# EAGLE design MLS01-TG000-C08 (EAGLE 9.6.2)
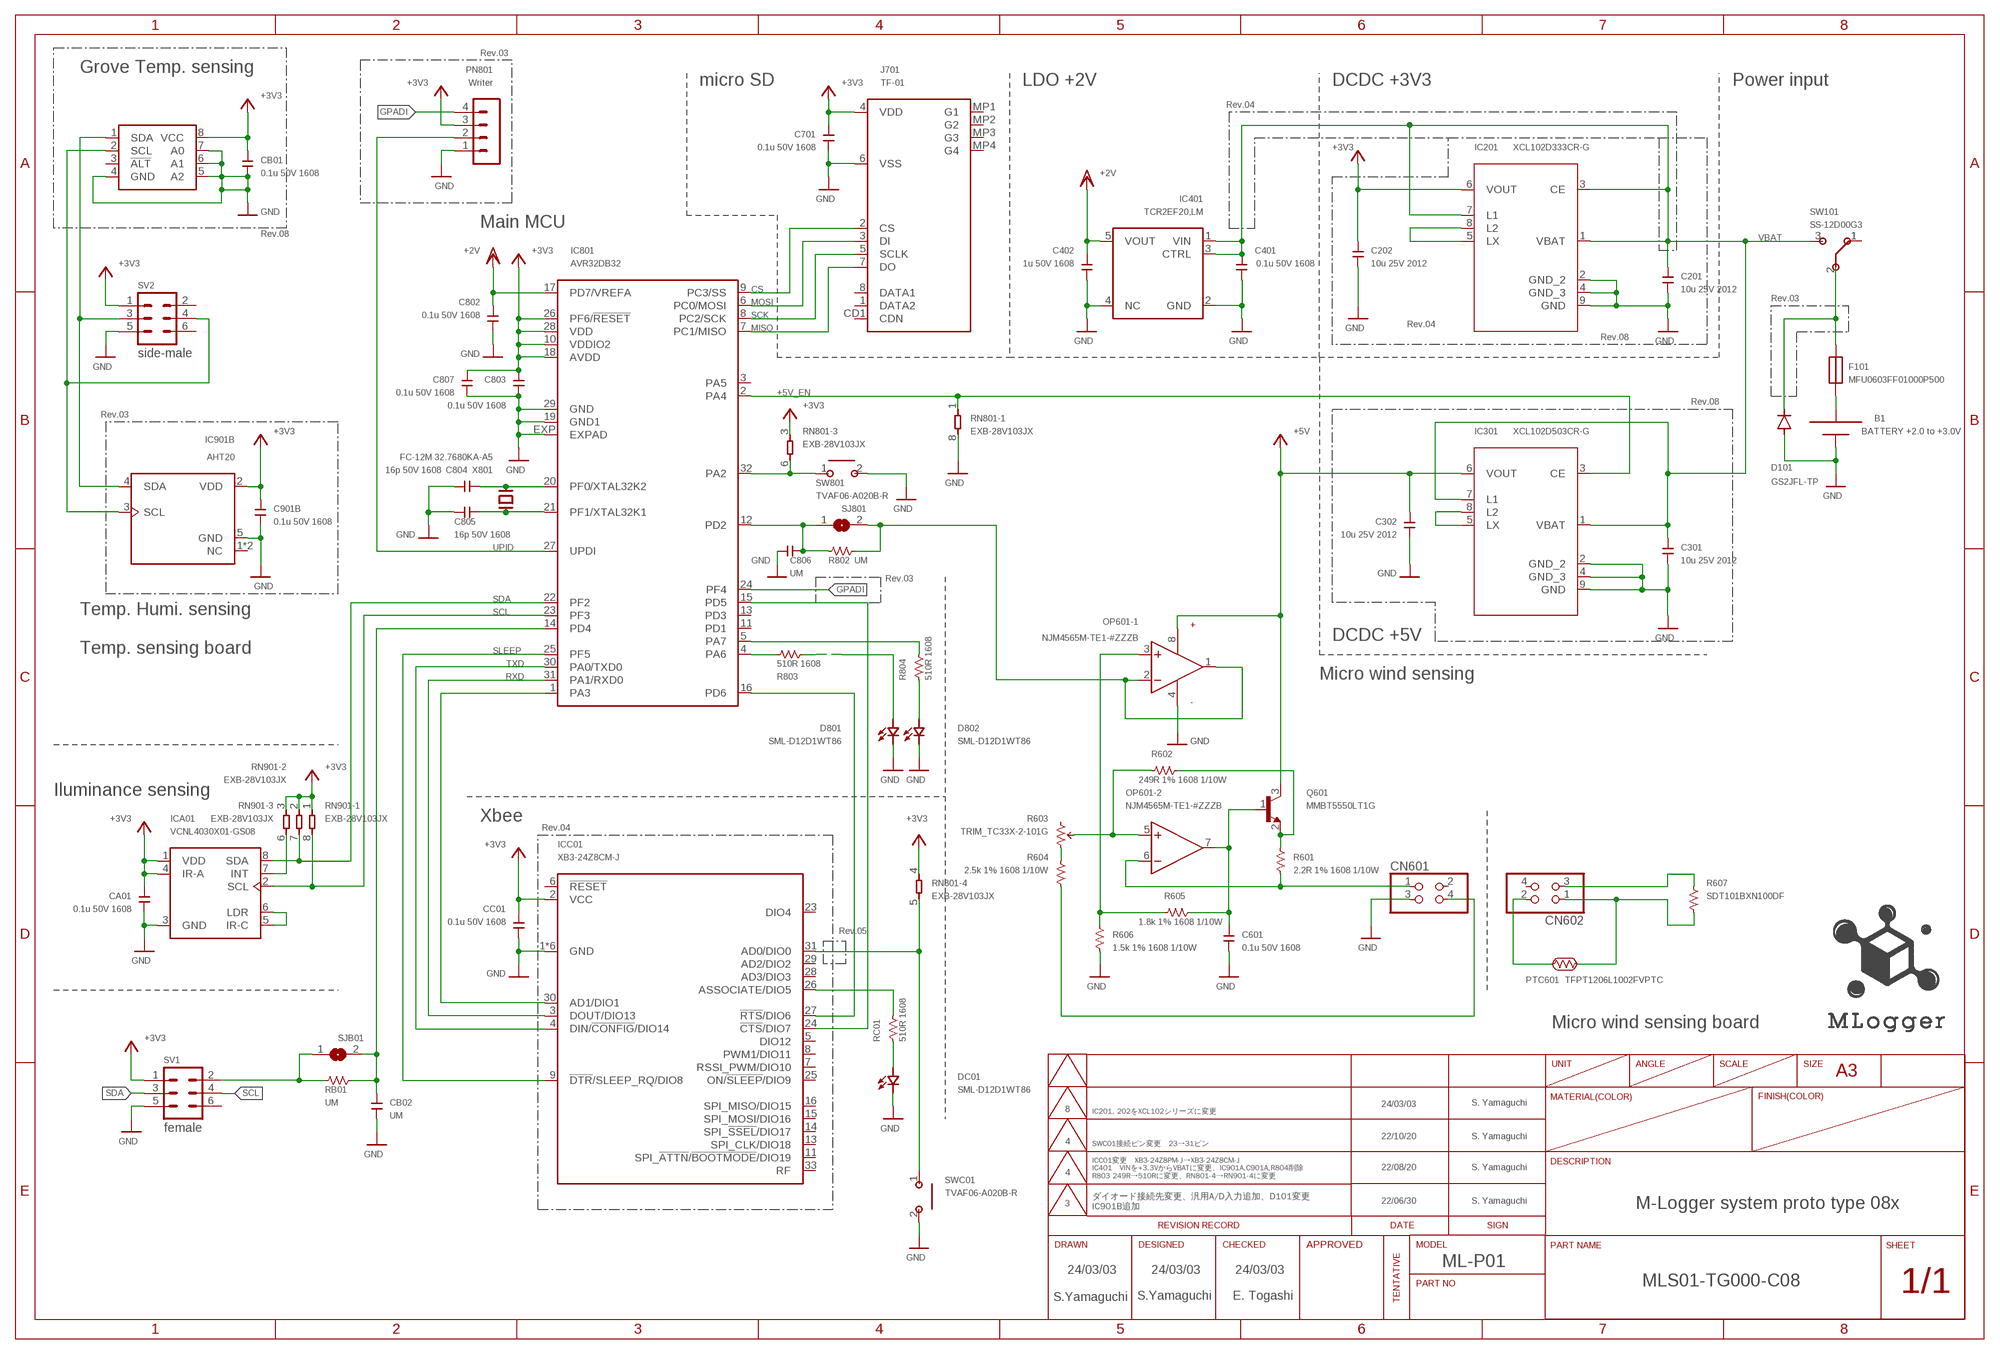
[diagram p0: schematic, sheet 1]

## Parts
B1  BATTERY +2.0 to +3.0V  BATTERY  [PAD]
C201  10u 25V 2012  CL21B105KBFNNNG  [C-2012/0805]
C202  10u 25V 2012  CL21B105KBFNNNG  [C-2012/0805]
C301  10u 25V 2012  CL21B105KBFNNNG  [C-2012/0805]
C302  10u 25V 2012  CL21B105KBFNNNG  [C-2012/0805]
C401  0.1u 50V 1608  CL10A105KP8NNNC  [C-1608/0603]
C402  1u 50V 1608  CL10A105KP8NNNC  [C-1608/0603]
C601  0.1u 50V 1608  CL10A105KP8NNNC  [C-1608/0603]
C701  0.1u 50V 1608  CL10A105KP8NNNC  [C-1608/0603]
C802  0.1u 50V 1608  CL10A105KP8NNNC  [C-1608/0603]
C803  0.1u 50V 1608  CL10A105KP8NNNC  [C-1608/0603]
C804  16p 50V 1608  CL10A105KP8NNNC  [C-1608/0603]
C805  16p 50V 1608  CL10A105KP8NNNC  [C-1608/0603]
C806  UM  CL10A105KP8NNNC  [C-1608/0603]
C807  0.1u 50V 1608  CL10A105KP8NNNC  [C-1608/0603]
C901B  0.1u 50V 1608  CL10A105KP8NNNC  [C-1608/0603]
CA01  0.1u 50V 1608  CL10A105KP8NNNC  [C-1608/0603]
CB01  0.1u 50V 1608  CL10A105KP8NNNC  [C-1608/0603]
CB02  UM  CL10A105KP8NNNC  [C-1608/0603]
CC01  0.1u 50V 1608  CL10A105KP8NNNC  [C-1608/0603]
CN601  PINHD-2X2  [2X02]
CN602  PINHD-2X2/90  [2X02/90]
D101  GS2JFL-TP  [SODFL5629X125N]
D801  SML-D12D1WT86  [SMD-1608]
D802  SML-D12D1WT86  [SMD-1608]
DC01  SML-D12D1WT86  [SMD-1608]
F101  MFU0603FF01000P500  [FUSC1608X60N]
IC201  XCL102D333CR-G  XCL102D503CR-GCL-2025-02_TOR  [CL-2025-02_TOR]
IC301  XCL102D503CR-G  XCL102D503CR-GCL-2025-02_TOR  [CL-2025-02_TOR]
IC401  TCR2EF20,LM  [SOT23-5L]
IC801  AVR32DB32  [HVQFN32]
IC901B  AHT20  [PSON100P300X300X110-6N]
ICA01  VCNL4030X01-GS08  [VISHAY_VCNL4030X01-GS08]
ICC01  XB3-24Z8CM-J  [XCVR_XB3-24Z8CM-J]
J701  TF-01  [TF-01A]
OP601  NJM4565M-TE1-#ZZZB  [SOIC127P680X175-8N]
PN801  Writer  MA04-1  [MA04-1]
PTC601  TFPT1206L1002FVPTC  [C1206]
Q601  MMBT5550LT1G  [SOT95P237X111-3N]
R601  2.2R 1% 1608 1/10W  R-1608  [R-1608/0603]
R602  249R 1% 1608 1/10W  R-1608  [R-1608/0603]
R603  TRIM_TC33X-2-101G  [TRIM_TC33X-2-101G]
R604  2.5k 1% 1608 1/10W  R-1608  [R-1608/0603]
R605  1.8k 1% 1608 1/10W  R-1608  [R-1608/0603]
R606  1.5k 1% 1608 1/10W  R-1608  [R-1608/0603]
R607  SDT101BXN100DF  [SDT101BXN100DF]
R802  UM  R-1608  [R-1608/0603]
R803  510R 1608  R-1608  [R-1608/0603]
R804  510R 1608  R-1608  [R-1608/0603]
RB01  UM  R-1608  [R-1608/0603]
RC01  510R 1608  R-1608  [R-1608/0603]
RN801  EXB-28V103JX  [RESCAXS50P200X100X45-8N]
RN901  EXB-28V103JX  [RESCAXS50P200X100X45-8N]
SJ801  SJ  [SJ]
SJB01  SJ  [SJ]
SV1  female  MA03-2-FEMALE  [MA03-2-FEMALE]
SV2  side-male  MA03-2-SIDE-MALE  [MA03-2-SIDE-MALE]
SW101  SS-12D00G3  [SS-12D00G3]
SW801  TVAF06-A020B-R  [TVAF06-A020B-R]
SWC01  TVAF06-A020B-R  [TVAF06-A020B-R]
U$4  P3T1570DP  [TSSOP8]
X801  FC-12M 32.7680KA-A5  SMD-CRYSTAL-32.768KHZ-12.5PF-20PPM-90K(2P-L2.0X1.2MM)  [X2-SMD-L2.0X1.2X0.55MM]

## Nets
+2V [PWR]: C402.P$1 C802.P$1 IC401.5(VOUT) IC801.17(PD7/VREFA)
+3V3: C202.P$2 C701.P$1 C803.P$1 C807.P$1 C901B.P$1 CA01.P$1 CB01.P$1 CC01.P$1 IC201.6(VOUT) IC801.10(VDDIO2) IC801.18(AVDD) IC801.26(PF6/!RESET) IC801.28(VDD) IC901B.2(VDD) ICA01.1(VDD) ICA01.4(IR-A) ICC01.2(VCC) J701.4(VDD) PN801.3 RN801.3 RN801.4 RN901.1 RN901.2 RN901.3 SV1.1 SV2.1 U$4.8(VCC)
+5V: C302.P$2 IC301.6(VOUT) OP601.8(-1:V+) Q601.3(C)
+5V_EN: IC301.3(CE) IC801.2(PA4) RN801.1
CS: IC801.9(PC3/SS) J701.2(CS)
GND: B1.2(-) C201.P$1 C202.P$1 C301.P$1 C302.P$1 C401.P$2 C402.P$2 C601.P$2 C701.P$2 C802.P$2 C803.P$2 C804.P$2 C805.P$2 C806.P$2 C807.P$2 C901B.P$2 CA01.P$2 CB01.P$2 CB02.P$2 CC01.P$2 CN601.3 D101.2(A) D801.2(C) D802.2(C) DC01.2(C) IC201.2(GND_2) IC201.4(GND_3) IC201.9(GND) IC301.2(GND_2) IC301.4(GND_3) IC301.9(GND) IC401.2(GND) IC401.4(NC) IC801.19(GND1) IC801.29(GND) IC801.EXP(EXPAD) IC901B.5(GND) ICA01.3(GND) ICC01.1(GND) ICC01.10(GND) ICC01.12(GND) ICC01.21(GND) ICC01.32(GND) ICC01.34(GND) J701.6(VSS) OP601.4(-1:V-) PN801.1 R606.1 RN801.8 SV1.5 SV2.5 SW801.2 SWC01.2 U$4.4(GND) U$4.5(A2) U$4.6(A1) U$4.7(A0)
GND_PIN: CN602.1 PTC601.1 R607.1
GPADI: IC801.24(PF4) PN801.4
MISO: IC801.7(PC1/MISO) J701.7(DO)
MOSI: IC801.6(PC0/MOSI) J701.3(DI)
N$1: D101.1(C) F101.2 SW101.2
N$2: CN602.3 R607.2
N$3: CN601.4 R604.1
N$4: RB01.1 SJB01.1 SV1.2
N$6: IC201.5(LX) IC201.8(L2)
N$8: IC301.5(LX) IC301.8(L2)
N$9: IC801.5(PA7) R804.2
N$10: D802.1(A) R804.1
N$11: OP601.1(-1:OUT) OP601.2(-1:-IN) R802.2 SJ801.2
N$12: ICC01.26(ASSOCIATE/DIO5) RC01.2
N$13: DC01.1(A) RC01.1
N$14: CN602.2 PTC601.2
N$15: OP601.3(-1:+IN) R605.1 R606.2
N$16: OP601.5(-2:+IN) R602.1 R603.2
N$17: R603.3 R604.2
N$18: IC801.4(PA6) R803.1
N$19: C601.P$1 OP601.7(-2:OUT) Q601.1(B) R605.2
N$20: CN601.1 OP601.6(-2:-IN) R601.1
N$21: IC801.1(PA3) ICC01.30(AD1/DIO1)
N$22: IC801.15(PD5) ICC01.24(!CTS!/DIO7)
N$23: IC801.16(PD6) ICC01.27(!RTS!/DIO6)
N$25: C806.P$1 IC801.12(PD2) R802.1 SJ801.1
N$26: B1.1(+) F101.1
N$30: Q601.2(E) R601.2 R602.2
N$31: ICA01.7(INT) RN901.6
N$39: D801.1(A) R803.2
N$49: IC801.32(PA2) RN801.6 SW801.1
N$50: C804.P$1 IC801.20(PF0/XTAL32K2) X801.1
N$51: C805.P$1 IC801.21(PF1/XTAL32K1) X801.2
N$56: ICC01.31(AD0/DIO0) RN801.5 SWC01.1
N$57: ICA01.5(IR-C) ICA01.6(LDR)
N$61: CB02.P$1 IC801.14(PD4) RB01.2 SJB01.2
RXD: IC801.31(PA1/RXD0) ICC01.3(DOUT/DIO13)
SCK: IC801.8(PC2/SCK) J701.5(SCLK)
SCL: IC801.23(PF3) IC901B.3(SCL) ICA01.2(SCL) RN901.8 SV1.4 SV2.4 U$4.2(SCL)
SDA: IC801.22(PF2) IC901B.4(SDA) ICA01.8(SDA) RN901.7 SV1.3 SV2.3 U$4.1(SDA)
SLEEP: IC801.25(PF5) ICC01.9(!DTR!/SLEEP_RQ/DIO8)
TXD: IC801.30(PA0/TXD0) ICC01.4(DIN/!CONFIG!/DIO14)
UPID: IC801.27(UPDI) PN801.2
VBAT: C201.P$2 C301.P$2 C401.P$1 IC201.1(VBAT) IC201.3(CE) IC201.7(L1) IC301.1(VBAT) IC301.7(L1) IC401.1(VIN) IC401.3(CTRL) SW101.3
Unconnected: CN601.2 CN602.4 IC801.3(PA5) IC801.11(PD1) IC801.13(PD3) IC901B.1(NC) IC901B.6(NC) ICC01.5(DIO12) ICC01.6(!RESET) ICC01.7(RSSI_PWM/DIO10) ICC01.8(PWM1/DIO11) ICC01.11(SPI_!ATTN!/!BOOTMODE!/DIO19) ICC01.13(SPI_CLK/DIO18) ICC01.14(SPI_!SSEL!/DIO17) ICC01.15(SPI_MOSI/DIO16) ICC01.16(SPI_MISO/DIO15) ICC01.23(DIO4) ICC01.25(ON/!SLEEP!/DIO9) ICC01.28(AD3/DIO3) ICC01.29(AD2/DIO2) ICC01.33(RF) J701.1(DATA2) J701.8(DATA1) J701.CD1(CDN) J701.MP1(G1) J701.MP2(G2) J701.MP3(G3) J701.MP4(G4) R603.1 RN801.2 RN801.7 RN901.4 RN901.5 SV1.6 SV2.2 SV2.6 SW101.1 U$4.3(!ALT)

## Notes on the sheet
- Rev.03
- Grove Temp. sensing
- micro SD | LDO +2V | DCDC +3V3 | Power input
- Rev.04
- Main MCU
- Rev.08
- Rev.03
- Rev.04
- Rev.08
- Rev.08
- Rev.03
- Rev.03
- Temp. Humi. sensing
- DCDC +5V
- Temp. sensing board
- Micro wind sensing
- Iluminance sensing
- Xbee
- Rev.04
- Rev.05
- Micro wind sensing board
- 24/03/03 | S. Yamaguchi
- 8 | IC201, 202をXCL102シリーズに変更
- 22/10/20 | S. Yamaguchi
- 4 | SWC01接続ピン変更　23→31ピン
- 22/08/20 | S. Yamaguchi
- 4
- ICC01変更　XB3-24Z8PM-J→XB3-24Z8CM-J
  IC401　VINを+3.3VからVBATに変更、IC901A,C901A,R804削除　
  R803 249R→510Rに変更、RN801-4→RN901-4に変更
- 3 | 22/06/30 | S. Yamaguchi
- ダイオード接続先変更、汎用A/D入力追加、D101変更
  IC901B追加
- M-Logger system proto type 08x
- ML-P01
- 24/03/03 | 24/03/03 | 24/03/03
- MLS01-TG000-C08
- S.Yamaguchi | S.Yamaguchi | E. Togashi

## Library data of the parts
B1 = yamaguchi:BATTERY
C201 C202 C301 C302 = yamaguchi:CL21B105KBFNNNG
C401 C402 C601 C701 C802-C807 C901B CA01 CB01 CB02 CC01 = yamaguchi:CL10A105KP8NNNC
CN601 CN602 = pinhead:PINHD-2X2: PIN HEADER
D101 = yamaguchi:GS2JFL-TP
D801 D802 DC01 = yamaguchi:SML-D12D1WT86
F101 = yamaguchi:MFU0603FF01000P500
IC201 IC301 = yamaguchi:XCL102D503CR-G; BUILT_BY: EMA_Cory; COPYRIGHT: Copyright (C) 2021 Accelerated Designs. All rights reserved; DATASHEET: https://www.torexsemi.com/file/xcl102/XCL102-103.pdf; MANUFACTURER_PART_NUMBER: XCL102D503CR-G; RS_PART_NUMBER_1: 893-1381-2-ND; RS_PART_NUMBER_2: 893-1381-1-ND; RS_PART_NUMBER_3: 893-1381-6-ND; SOURCELIBRARY: Add_to_database_2022-04-06; VENDOR: Torex Semiconductor
IC401 = yamaguchi:TCR2EF20,LM
IC801 = yamaguchi:AVR32DB32
IC901B = yamaguchi:AHT20: Temperature and Humidity sensor Check availability; AVAILABILITY: Not in stock; DESCRIPTION: Temperature and Humidity sensor; MF: Asair; MP: AHT20; PACKAGE: Package; PRICE: None
ICA01 = yamaguchi:VCNL4030X01-GS08: VCNL4030 Fully Integrated Proximity and Ambient Light Sensor with Infrared Emitter, I2C Interface, and Interrupt Function: VCNL4030X01 integrates a proximity sensor (PS), ambient light sensor (ALS), and a high power IRED into one small package. It incorporates photodiodes, amplifiers, and analog to digital converting circuits into a single chip by CMOS process. The 16-bit high resolution ALS offers excellent sensing capabilities with sufficient selections to fulfill most applications whether dark or high transparency lens design. Both ALS and PS programmable interrupt features of individual high and low thresholds offers the best utilization of resource and power saving on the microcontroller. Device Model created 15.06.2016 by Johannes Kolb - Vishay Semiconductor GmbH Check availability; AVAILABILITY: In Stock; DESCRIPTION: Proximity + Ambient Light Sensor, I²C Interface, 4 Slave Addresses; MF: Vishay; MP: VCNL4030X01-GS08; PACKAGE: QFN-8 Vishay; PRICE: None; PURCHASE-URL: https://pricing.snapeda.com/search/part/VCNL4030X01-GS08/?ref=eda
ICC01 = yamaguchi:XB3-24Z8CM-J: XBee3, 2.4 GHz ZB 3.0, Chip Ant, MMT Check availability; AVAILABILITY: In Stock; DESCRIPTION: 802.15.4 Zigbee® Transceiver Module 2.4GHz Integrated, Chip Surface Mount; MF: Digi International; MP: XB3-24Z8CM-J; PACKAGE: SMD-34 Digi International; PRICE: None; PURCHASE-URL: https://pricing.snapeda.com/search/part/XB3-24Z8CM-J/?ref=eda
J701 = yamaguchi:TF-01
OP601 = yamaguchi:NJM4565M-TE1-#ZZZB
PN801 = yamaguchi:MA04-1: PIN HEADER; OC_FARNELL: unknown; OC_NEWARK: unknown
PTC601 = yamaguchi:TFPT1206L1002FV
Q601 = yamaguchi:MMBT5550LT1G
R601 R602 R604-R606 R802-R804 RB01 RC01 = yamaguchi:R-1608: R 1608/0603
R603 = yamaguchi:TRIM_TC33X-2-101G
R607 = yamaguchi:SDT101BXN100DF
RN801 RN901 = yamaguchi:EXB-28V103JX
SJ801 SJB01 = yamaguchi:SJ: SMD solder JUMPER
SV1 = yamaguchi:MA03-2-FEMALE: PIN HEADER; OC_FARNELL: unknown; OC_NEWARK: unknown
SV2 = yamaguchi:MA03-2-SIDE-MALE: PIN HEADER; OC_FARNELL: unknown; OC_NEWARK: unknown
SW101 = yamaguchi:SS-12D00G3
SW801 SWC01 = yamaguchi:TVAF06-A020B-R
U$4 = yamaguchi:P3T1570DP
X801 = yamaguchi:SMD-CRYSTAL-32.768KHZ-12.5PF-20PPM-90K(2P-L2.0X1.2MM): 306010020 Check availability; AVAILABILITY: In Stock; DESCRIPTION: 32.768 kHz ±30ppm Crystal 12.5pF 90 kOhms 2-SMD, No Lead; MF: EPSON; MP: FC-12M; PACKAGE: SMD-2 EPSON; PRICE: None; PURCHASE-URL: https://pricing.snapeda.com/search/part/FC-12M/?ref=eda

## Net classes
0 default: width 0.127 mm
1 GND: width 0.127 mm
2 PWR: width 0.127 mm

## Board
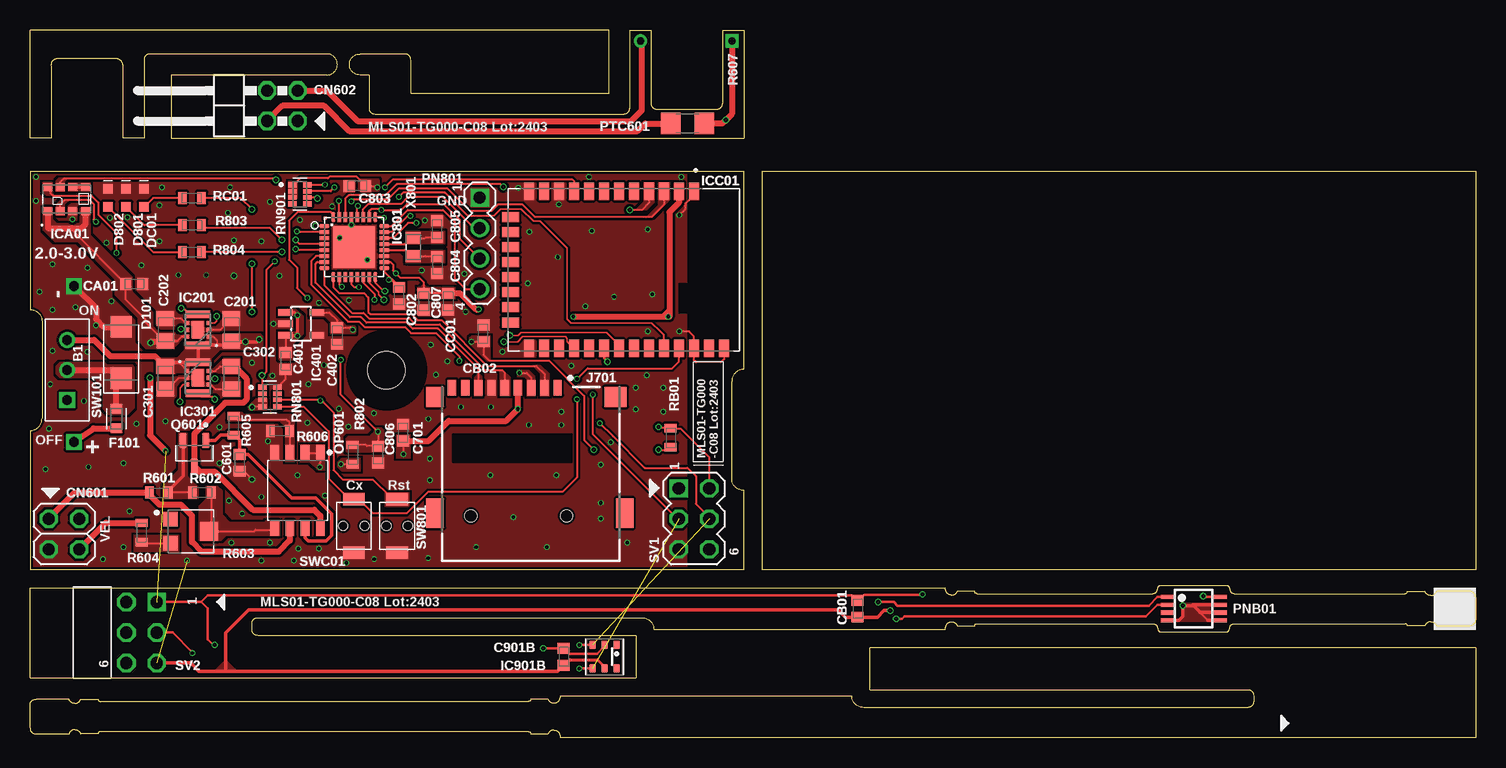
[diagram p1: board, top side]
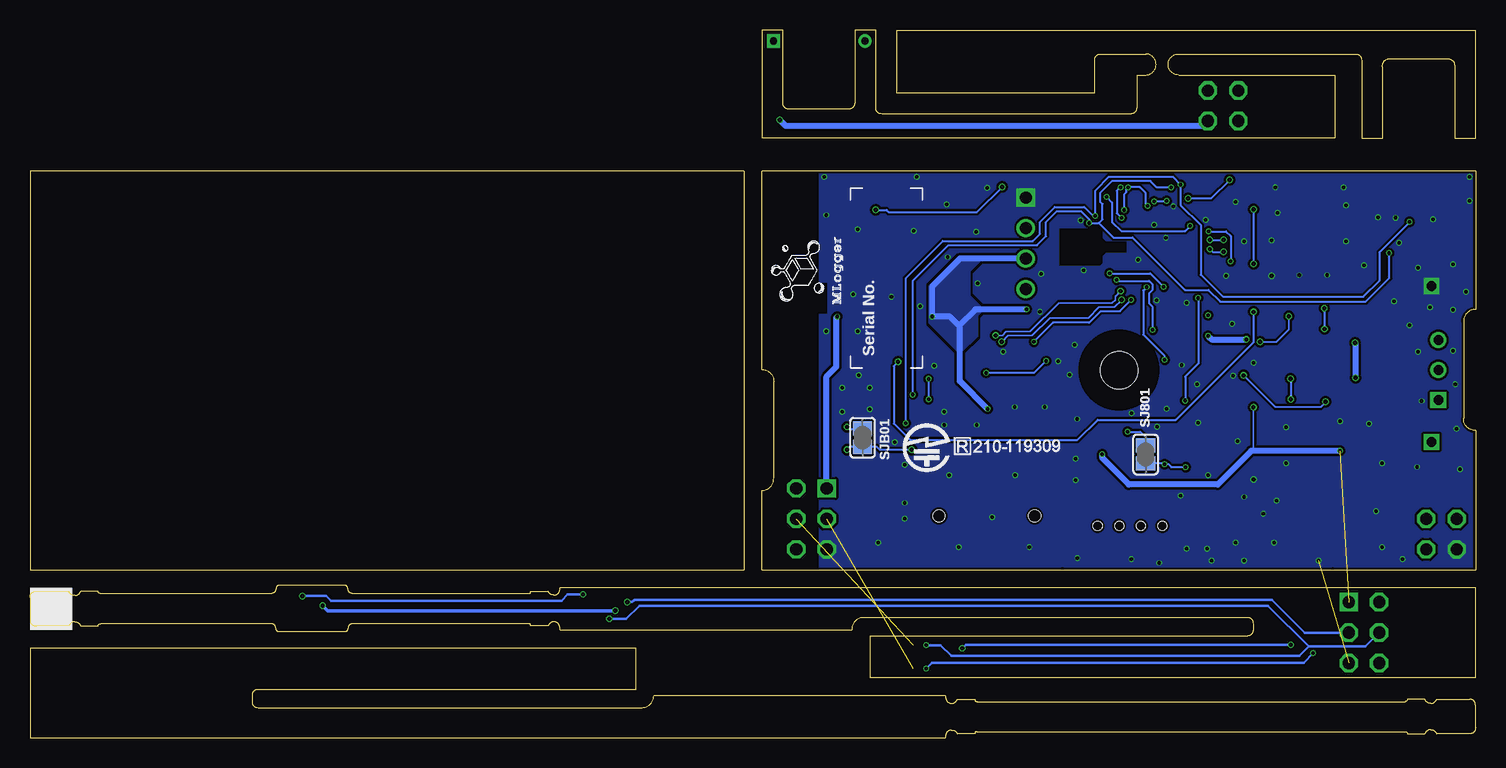
[diagram p2: board, bottom side, seen from below]

Size 120.5 x 59 mm. Coordinates in mm from the lower left corner, seen from the top.
Outline: 144 segments
Copper layers (1*16): Top 0.035mm / dielectric 1.2mm / Bottom 0.035mm
Design rules "jlcpcb-2layers-custom": minimum track width 5mil, minimum drill 0.3mm, track to track 0.205mm, track to pad 0.205mm, pad to pad 0.205mm, via to via 0.205mm, smd to smd 5mil, copper to edge 0.2mm, drill to drill 6mil, minimum pad ring 10mil, minimum via ring 3mil, stop-mask expansion 0.002540625mm, vias tented up to drill 0.3mm, thermal gap 10mil
Holes 3.1 mm at 29.72,30.64
tKeepout: area 9.5,40.5 to 11.5,47.5; area -0.5,40.5 to 10,42.5
tRestrict: area 26.4,27.3 to 33,33.9; 13 lines
bRestrict: area 26.4,27.3 to 33,33.9; area 29.1,39.4 to 34.6,42.5; area 54.1,35.4 to 54.8,37.9

### Footprints (pad centres in the part's own frame; a part is rotated, then mirrored left to right if it is on the bottom)
PAD = drill 0.8 square: 1 0,-6.5; 2 0,6.5
C-2012/0805 = smd 1.25 x 1.45: P$1 -0.95,0; P$2 0.95,0
C-1608/0603 = smd 0.9 x 1: P$1 -0.7,0; P$2 0.7,0
2X02 = drill 1.016 octagon: 1 -1.27,-1.27; 2 -1.27,1.27; 3 1.27,-1.27; 4 1.27,1.27
2X02/90 = drill 1.016 octagon: 1 -1.27,-6.35; 2 -1.27,-3.81; 3 1.27,-6.35; 4 1.27,-3.81
SODFL5629X125N = smd 1.812 x 1.762: 1 -2.15,0; 2 2.15,0
SMD-1608 = smd 0.8 x 0.8: 1 -0.75,0; 2 0.75,0
FUSC1608X60N = smd 0.799 x 0.974: 1 -0.815,0; 2 0.815,0
CL-2025-02_TOR = smd 0.254 x 0.34: 1 -0.855,0.55; 2 -0.855,0; 3 -0.855,-0.55; 4 0.855,-0.55; 5 0.855,0; 6 0.855,0.55 | smd 2.057 x 0.635: 7 0,1.283; 8 0,-1.283 | smd 1.041 x 1.473: 9 0,0
SOT23-5L = smd 0.55 x 1.2: 1 -0.95,-1.3; 2 0,-1.3; 3 0.95,-1.3; 4 0.95,1.3; 5 -0.95,1.3
HVQFN32 = smd 0.8 x 0.3: 1 -2.5,1.75; 2 -2.5,1.25; 3 -2.5,0.75; 4 -2.5,0.25; 5 -2.5,-0.25; 6 -2.5,-0.75; 7 -2.5,-1.25; 8 -2.5,-1.75; 17 2.5,-1.75; 18 2.5,-1.25; 19 2.5,-0.75; 20 2.5,-0.25; 21 2.5,0.25; 22 2.5,0.75; 23 2.5,1.25; 24 2.5,1.75 | smd 0.3 x 0.8: 9 -1.75,-2.5; 10 -1.25,-2.5; 11 -0.75,-2.5; 12 -0.25,-2.5; 13 0.25,-2.5; 14 0.75,-2.5; 15 1.25,-2.5; 16 1.75,-2.5; 25 1.75,2.5; 26 1.25,2.5; 27 0.75,2.5; 28 0.25,2.5; 29 -0.25,2.5; 30 -0.75,2.5; 31 -1.25,2.5; 32 -1.75,2.5 | smd 3.5 x 3.5: EXP 0,0 | smd 0.25 x 0.25: M1 -2.415,2.415
PSON100P300X300X110-6N = smd 0.71 x 0.53: 1 -0.985,1; 2 -0.985,0; 3 -0.985,-1; 4 0.985,-1; 5 0.985,0; 6 0.985,1
VISHAY_VCNL4030X01-GS08 = smd 0.65 x 0.75: 1 -1.005,1.575; 2 -1.005,0.525; 3 -1.005,-0.525; 4 -1.005,-1.575; 5 1.005,-1.575; 6 1.005,-0.525; 7 1.005,0.525; 8 1.005,1.575
XCVR_XB3-24Z8CM-J = smd 1.448 x 0.838: 1 -6.553,5.842; 2 -6.553,4.592; 3 -6.553,3.343; 4 -6.553,2.093; 5 -6.553,0.843; 6 -6.553,-0.406; 7 -6.553,-1.656; 8 -6.553,-2.906; 9 -6.553,-4.155; 10 -6.553,-5.405; 11 -6.553,-6.655; 12 -6.553,-7.904; 21 6.553,-7.904; 22 6.553,-6.655; 23 6.553,-5.405; 24 6.553,-4.155; 25 6.553,-2.906; 26 6.553,-1.656; 27 6.553,-0.406; 28 6.553,0.843; 29 6.553,2.093; 30 6.553,3.343; 31 6.553,4.592; 32 6.553,5.842; 33 6.553,7.092; 34 6.553,8.357 | smd 0.838 x 1.448: 13 -4.381,-9.436; 14 -3.132,-9.436; 15 -1.882,-9.436; 16 -0.632,-9.436; 17 0.617,-9.436; 18 1.867,-9.436; 19 3.117,-9.436; 20 4.381,-9.436
TF-01A = smd 0.7 x 1.3: 1 2.23,7.174; 2 1.13,7.174; 3 0.03,7.174; 4 -1.07,7.174; 5 -2.17,7.174; 6 -3.27,7.174; 7 -4.37,7.174; 8 -5.47,7.174; CD1 -6.57,7.174 | smd 1.448 x 1.651: MP1 -7.989,6.4 | smd 1.448 x 2.438: MP2 -7.989,-3.3; MP3 7.836,-3.3 | smd 1.854 x 1.651: MP4 7.061,6.4 | hole 1: -5.004,-3.531; 2.972,-3.531
SOIC127P680X175-8N = smd 1.3 x 0.72: 1 -3.15,1.905; 2 -3.15,0.635; 3 -3.15,-0.635; 4 -3.15,-1.905; 5 3.15,-1.905; 6 3.15,-0.635; 7 3.15,0.635; 8 3.15,1.905
MA04-1 = drill 1.016 square: 1 -3.81,0 | drill 1.016: 2 -1.27,0; 3 1.27,0; 4 3.81,0
C1206 = smd 1.6 x 1.8: 1 -1.4,0; 2 1.4,0
SOT95P237X111-3N = smd 1.23 x 0.6: 1 -1.06,0.95; 2 -1.06,-0.95; 3 1.06,0
R-1608/0603 = smd 0.7 x 1: 1 -0.8,0; 2 0.8,0
TRIM_TC33X-2-101G = smd 1.2 x 1.2: 1 -1.8,1; 3 -1.8,-1 | smd 1.5 x 1.6: 2 1.45,0
SDT101BXN100DF = drill 0.6 square: 1 -3.81,0 | drill 0.6: 2 3.81,0
RESCAXS50P200X100X45-8N = smd 0.79 x 0.44: 1 -0.62,0.8; 4 -0.62,-0.8; 5 0.62,-0.8; 8 0.62,0.8 | smd 0.79 x 0.34: 2 -0.62,0.25; 3 -0.62,-0.25; 6 0.62,-0.25; 7 0.62,0.25
SJ = smd 1.168 x 1.6: 1 -0.762,0; 2 0.762,0
MA03-2-FEMALE = drill 1.016 square: 1 -2.54,-1.27 | drill 1.016 octagon: 2 -2.54,1.27; 3 0,-1.27; 4 0,1.27; 5 2.54,-1.27; 6 2.54,1.27
MA03-2-SIDE-MALE = drill 1.016 square: 1 -2.54,1.27 | drill 1.016 octagon: 2 -2.54,-1.27; 3 0,1.27; 4 0,-1.27; 5 2.54,1.27; 6 2.54,-1.27
SS-12D00G3 = drill 0.8 square: 1 -2.5,0 | drill 0.8: 2 0,0; 3 2.5,0
TVAF06-A020B-R = smd 1.05 x 1.8: 1 -2.225,0; 2 2.225,0 | hole 0.75: 0,0.9; 0,-0.9
TSSOP8 = smd 1.15 x 0.35: 1 -2.175,0.975; 2 -2.175,0.325; 3 -2.175,-0.325; 4 -2.175,-0.975; 5 2.175,-0.975; 6 2.175,-0.325; 7 2.175,0.325; 8 2.175,0.975
X2-SMD-L2.0X1.2X0.55MM = smd 1 x 1.25: 1 -0.75,0; 2 0.75,0

### Placement (x,y rotation side)
B1  3.66,31.15 0 top
C201  16.8,34 270 top
C202  11.3,34 270 top
C301  11.3,30 90 top
C302  16.8,30 90 top
C401  21.3,31.4 270 top
C402  25.6,33.5 270 top
C601  17.47,22.91 270 top
C701  31.12,25.43 90 top
C802  30.75,36.85 270 top
C803  27.3,46 180 top
C804  33.95,39.4 270 top
C805  33.95,42.4 90 top
C806  29,23.6 270 top
C807  32.81,36.35 270 top
C901B  44.49,6.73 270 top
CA01  8.69,37.83 0 top
CB01  68.99,10.74 270 top
CB02  37.8,33.7 90 top
CC01  34.85,36.35 270 top
CN601  2.84,16.96 270 top
CN602  15.96,52.68 90 top
D101  7.6,32.1 90 top
D801  8,45 90 top
D802  6.5,45 90 top
DC01  9.5,45 90 top
F101  7.2,26.6 90 top
IC201  14,34 180 top
IC301  14,30 0 top
IC401  22.6,34.5 270 top
IC801  27.03,40.9 0 top
IC901B  47.9,6.75 270 top
ICA01  3.05,44.9 90 top
ICC01  49.5,39 270 top
J701  41.75,22 0 top
OP601  22.3,20.6 270 top
PN801  37.49,41.21 270 top
PTC601  54.81,51.2 180 top
Q601  13.7,23.7 270 top
R601  10.76,20.42 0 top
R602  14.34,20.43 180 top
R603  13.5,17.2 0 top
R604  9.3,17.1 270 top
R605  16.97,26.01 270 top
R606  20.83,25.58 0 top
R607  54.71,58.09 180 top
R802  26.9,23.6 270 top
R803  13.5,42.72 180 top
R804  13.5,40.5 0 top
RB01  53.4,25 270 top
RC01  13.5,45 0 top
RN801  20,28.4 0 top
RN901  22.5,45.3 0 top
SJ801  27.5,23.6 270 bottom
SJB01  51.1,25 270 bottom
SV1  55.36,18.23 270 top
SV2  9.3,8.75 270 top
SW101  3.1,30.65 90 top
SW801  30.6,17.65 270 top
SWC01  27,17.65 270 top
U$2  [SERIAL_NO]  52.1,30.8 90 bottom
U$3  [MLOGGER_LOGO]  52.1,34.9 90 bottom
U$4  97,10.75 0 top
X801  31.95,40.9 90 top

### Tracks (layer width: path | path; a pad name or v marks a point on that pad's centre or on a via)
+2V  (via drill 0.3)
  Top 0.152: IC801.17 29.53,38.87 30.75,37.65 C802.P$1 30.14,38.16 v29.9,38.16 | IC401.5 24.95,35.45 25.6,34.8 C402.P$1 26.7,34.2 v26.9,34
  Bottom 0.152: v26.9,34 26.9,35.9 27.2,36.2 27.2,37.04 26.9,37.34 26.9,37.78 27.2,38.08 29.82,38.08 v29.9,38.16
  pour Top (no thermals): 23.3,35.1 24.6,35.1 25,34.7 25,33.7 27.1,33.7 27.2,33.8 27.2,34.2 27.1,34.3 26.4,34.3 25,35.7 23.3,35.7
+3V3  (via drill 0.3, 0.35)  (1 unrouted)
  Top 0.127: RN801.3 RN801.4 18.57,27.6 v18.51,27.54
  Top 0.15: 15.27,7.73 v15.4,7.73
  Top 0.152: C701.P$1 v31.12,23.63 | IC801.18 30.05,39.65 30.26,39.44 30.26,38.95 v30.5,38.7 30.86,38.35 32.45,38.35 32.81,37.99 C807.P$1 CC01.P$1 | v28.94,45.89 28.83,46 C803.P$1 27.21,46.79 24.99,46.79 24.84,46.64 22.54,46.64 22,46.1 RN901.1 RN901.2 RN901.3 | IC801.26 28.28,43.92 28.44,44.08 29.19,44.08 v29.29,43.98 30.92,43.98 31.43,44.5 34.48,44.5 35.8,43.19 35.8,41.6 37.46,39.94 PN801.3 | IC801.28 27.28,44.28 v27.34,44.34 | 40.68,27.38 v40.68,27.4 | IC801.10 25.78,37.77 v25.98,37.57 | C901B.P$1 44.57,7.43 | 47.9,7.65 IC901B.2 | SV2.1 10.59,11.31 | C202.P$2 10.87,33.53 10.74,33.53 9.62,34.65 9.62,34.88 7.99,36.51 CA01.P$1 3.5,42.32 3.5,42.5 | 69.09,11.44 CB01.P$1 68.89,11.44
  Top 0.2: 44.57,7.43 45,7 47.25,7 47.9,7.65 | 10.59,11.31 14.27,11.31 | 68.89,11.44 68.49,11.84 14.8,11.84 14.27,11.31 | C202.P$2 12.25,33.05 12.65,33.45 13.16,33.45 | C901B.P$1 v42.79,7.43 | 14.27,11.31 14.8,10.77 14.8,8.2 15.27,7.73 | U$4.8 97.88,11.72 v97.8,11.8 | 69.09,11.44 69.55,11.9 74.37,11.9 v74.4,11.93
  Top 0.305: 11.65,33.45 C202.P$2
  Top 0.508: ICA01.4 4.62,42.83 4.3,42.5 3.5,42.5 1.49,42.5 1.49,43.88 ICA01.1 | ICC01.2 54.09,44.59 53.3,43.8 53.3,35.6 | 53.3,35.6 53.3,35.1 v53.2,35.1 52.8,35.1 | v45.3,35.1 52.8,35.1 | C701.P$1 33.23,24.73 34.9,26.4 39.7,26.4 40.68,27.38 | v40.68,27.4 J701.4 | CC01.P$1 35.85,37.05 37.2,35.7 v37.4,35.7 | 52.8,35.1 53.3,35.6 | v10,30 10,25.2 v11.3,23.9 | v10.05,32.92 10.13,33 11.25,33 C202.P$2
  Bottom 0.127: v18.51,27.54 18.51,24.11 18.3,23.9
  Bottom 0.152: v29.29,43.98 29.29,45.3 29.09,45.5 29.09,45.74 v28.94,45.89 27.99,45.89 27.5,45.4 27.5,44.5 v27.34,44.34 | v25.98,37.57 27.12,38.7 v30.5,38.7
  Bottom 0.2: v42.79,7.43 42.49,7.73 v15.4,7.73 | v97.8,11.8 95.8,11.8 95.4,11.4 76.2,11.4 75.67,11.93 v74.4,11.93
  Bottom 0.508: PN801.3 42.96,39.94 45.3,37.6 v45.3,35.1 43.8,35.1 43.05,34.35 | v11.3,23.9 18.3,23.9 18.7,23.9 21.5,21.1 28.9,21.1 31.12,23.32 v31.12,23.63 | v40.68,27.4 43,29.72 43,34.3 43.05,34.35 | v37.4,35.7 41.7,35.7 43.05,34.35 | SV1.1 54.09,30.11 53.3,30.9 53.3,35 v53.2,35.1 | v10,30 10,32.87 v10.05,32.92
  pour Top (no thermals): 35.45,37.55 35.45,36.55 32.31,36.55 32.31,37.55 32.55,37.55 32.8,37.8 33.05,37.55
  pour Top (no thermals): 31.72,25.23 30.52,25.23 30.52,23.33 31.72,23.33
  pour Top (no thermals): 21.53,44.92 22.3,44.92 22.3,46.36 21.53,46.36
  pour Top (no thermals): 27.4,46.6 29,46.6 29.12,46.48 29.12,45.61 29.01,45.5 27.5,45.5 27.4,45.6
  pour Bottom (no thermals): 41.2,35.9 42.1,36.8 42.1,38.9 40.86,40.14 43.05,40.14 45.6,37.59 45.6,34.6 43.2,32.2 42.8,32.2 41.5,33.5 41.5,35.2 41.2,35.5
  pour Bottom (no thermals): 43.2,29.8 40.5,27.4 40.5,27.5 42.8,29.8
  pour Top (no thermals): 1.1,44.2 1.86,44.2 1.86,43.24 2.2,42.9 4.1,42.9 4.2,43 4.2,44.2 5,44.2 5,41.9 8.5,38.4 8.5,37.2 10.22,35.48 10.22,34.3 10.7,33.8 12,33.8 12,32.4 9.7,32.4 9,33.1 9,35 7.1,36.9 7.1,38.2 4,41.3 2.1,41.3 1.1,42.3
  pour Top (no thermals): 10.7,33.8 12,33.8 12.2,33.6 13.3,33.6 13.3,33.31 12.77,33.31 12,32.54 12,32.4 10.7,32.4
  pour Top (no thermals): 18.85,28.28 19.76,28.28 19.76,27.35 19.69,27.28 18.31,27.28 18.24,27.35 18.24,27.67
+5V
  Top 0.15: IC301.6 15.45,30.55 15.85,30.95 C302.P$2
  Top 0.508: C302.P$2 17.05,30.65 17.34,30.65 18.06,29.93 18.06,28.18 17.78,27.9 16.27,27.9 13.69,25.32 Q601.3 14.2,22.14 15.44,22.14 18.58,19 23.7,19 24.2,18.5 OP601.8
  pour Top (no thermals): 14.7,30.4 16,30.4 16.1,30.3 17.5,30.3 17.5,31.6 16.14,31.6 15.23,30.69 14.7,30.69
+5V_EN  (via drill 0.3, 0.35)
  Top 0.127: v19.33,30.2 19.38,30.15 RN801.1 | v12.5,28 12.5,29.16 12.79,29.45 IC301.3
  Top 0.152: IC801.2 22.3,42.15 v22.25,42.2 | v20.4,39.7 19.71,39.01 19.71,30.51 19.38,30.18 RN801.1
  Bottom 0.127: v12.5,28 12.5,27.95 12.88,27.57 16.7,27.57 v19.33,30.2
  Bottom 0.152: v22.25,42.2 20.8,42.2 20.4,41.8 v20.4,39.7
CS
  Top 0.152: IC801.9 25.28,37.56 25.78,37.05 27.85,37.05 28.2,36.7 28.2,35.5 28.4,35.3 31.8,35.3 32.3,34.8 34.3,34.8 38.1,31 42.2,31 42.88,30.32 J701.2
  pour Top (no thermals): 41.88,31.02 42.5,30.4 42.5,28.5 43.3,28.5 43.3,30.3 42.58,31.02
GND  (via drill 0.3, 0.35)  (1 unrouted)
  Top 0.127: C601.P$2 17.81,22.21 v18.5,21.52 | 99.13,11.07 U$4.7 | C301.P$1 11.45,29.05 12.4,30 IC301.2 | 98.2,9.78 97.58,10.4 97.58,10.43
  Top 0.15: IC301.4 15.05,29.45 15.45,29.05 C302.P$1 | 12.65,34.89 12.59,34.95 C202.P$1
  Top 0.152: C901B.P$2 44.59,6.03 | 47.9,5.9 IC901B.5 | ICC01.34 57.86,31.56 57.6,31.3 55.5,31.3 55.34,31.46 ICC01.32 55.34,33.46 54.94,33.86 v54.12,33.86 | ICC01.1 55.34,45.24 54.63,44.53 54.63,44.37 54.6,44.34 54.6,44.04 v54.12,43.56 | RN801.8 21.3,29.88 C401.P$2 | IC201.4 13.04,34.68 12.86,34.68 12.65,34.89 | IC201.2 15.85,34 C201.P$1
  Top 0.254: 44.59,6.03 45.06,6.5 47.3,6.5 47.9,5.9
  Top 0.305: C901B.P$2 43.99,5.53 16.3,5.53 | 16.3,5.53 14.07,5.53 13.39,6.21 SV2.5 | v71.71,10.58 71.69,10.6 71.2,10.6 70.64,10.04 CB01.P$2 67.96,10.04 67.33,10.66 18.21,10.66 16.3,8.75 16.3,5.53 | 97,11 v96.1,11 96.1,10.1 95.78,9.78 U$4.4 | 99.13,11.07 96.93,11.07 97,11 | U$4.6 97.58,10.43 | 97.58,10.43 97.54,10.43 | 97.58,10.43 97,11 | U$4.5 99.13,9.78 98.2,9.78
  Top 0.508: B1.2 5.5,35.81 5.5,34.9 6.15,34.25 D101.2
  Bottom 0.305: v71.71,10.58 95.68,10.58 v96.1,11
  other vias: 32.92,43.13 32.65,38.95 28.66,27.04 28.12,39.83 25.81,41.68 51.4,30.2 46.6,46.74 40.7,45.84 44.1,44.46 36.2,38.66 36.31,35.51 33.4,32.76 24.5,31.06 20.29,34.5 3.53,43.21 26.78,42.75 20.2,30.16 19.82,24.72 24.1,36.26 0.5,46.76 0.5,44.76 23.22,29.46 23.12,26.26 33.32,21.46 33.32,23.26 33.22,26.56 38.42,27.56 35.92,27.56 33.82,30.26 41.62,42.16 46.82,42.26 19.29,14.76 21.99,14.76 24.09,15.76 22.39,15.76 28.69,14.86 33.19,14.96 43.89,21.86 38.39,21.86 43.09,15.86 47.59,18.26 47.59,22.76 47.59,19.56 37.19,15.86 44.29,27.16 44.29,26.06 34.79,31.36 39.39,32.16 25.75,27.43 26.55,25.93 49.79,16.26 40.29,18.36 46.29,35.96 43.99,40.06 41.49,37.86 51.49,42.36 51.89,36.96 48.69,36.76 45.14,30.98 48.4,24.62 17,38.5 10.79,44.36 4.79,39.16 9.29,39.36 19.99,44.66 10.79,41.36 25.19,44.3 11.29,26.36 7.79,22.86 1.29,22.36 8.29,18.86 16.59,19.76 19.99,16.26 22.29,21.86 24.59,20.16 15.79,25.86 6.79,36.36 3.79,35.86 19.29,41.36 20.79,38.5 51.49,33.86 7.79,15.86 15.79,22.86 18.5,31.26 26.6,36.46 6.39,41.26 6.67,43.35 8.13,43.37 16.49,43.76 10.99,45.86 16.69,45.86 0.79,37.16 1.89,39.46 12.39,38.56 14.69,38.56 4.89,22.56 1.59,25.76 8.89,26.16 4.79,32.16 5.49,34.36 4.49,28.06 1.69,29.46 1.89,32.26 1.89,35.66 6.09,14.86 13.09,14.76 26.39,14.56 17.69,18.66 16.79,16.26 19.29,20.06 41.59,26.06 52.79,29.16 52.79,27.16 50.49,27.36 50.49,29.16 54.3,46.74 22.49,43.16 16.99,41.46
  pour Top (rank 2, no thermals): 0.25,47 54.73,47 54.73,14.25 0.25,14.25
  pour Bottom (rank 2, no thermals): 0.25,47 54.73,47 54.73,14.25 0.25,14.25
  pour Top (no thermals): 16.3,6.5 17.3,5.5 15.4,5.5 15.3,5.5
  pour Top (no thermals): 95.77,9.67 98.4,9.67 98.4,11.2 96.1,11.2 96.1,10
GND_PIN  (via drill 0.35)
  Top 0.508: R607.1 58.5,58.07 58.5,52 v58,51.5 57.7,51.2 PTC601.1
  Bottom 0.508: v58,51.5 57.5,51 22.72,51 CN602.1
GPADI
  Top 0.152: PN801.4 36.3,37.4 35.4,38.3 35.4,43.03 34.43,44 31.48,44 30.14,42.65 IC801.24
MISO
  Top 0.152: J701.7 37.38,30.71 34,34.09 31.9,34.09 31.4,34.59 28.05,34.59 27.59,35.04 26.68,35.04 23.8,37.92 23.8,39.5 23.95,39.65 IC801.7
  pour Top (no thermals): 37,28.5 37.7,28.5 37.7,30.1 37.4,30.4 37,30
MOSI  (via drill 0.3)
  Top 0.152: IC801.6 23.85,40.15 23.44,39.74 23.44,37.75 26.51,34.69 27.44,34.69 27.9,34.23 31.26,34.23 31.76,33.73 33.86,33.73 35.8,31.78 v35.8,31.4 | v40.8,30.4 41.4,30.4 41.78,30.02 J701.3
  Bottom 0.152: v35.8,31.4 36.8,30.4 v40.8,30.4
  pour Top (no thermals): 40.6,30.1 41.2,30.1 41.4,29.9 41.4,28.5 42.1,28.5 42.1,30.1 41.6,30.6 40.6,30.6
N$1
  Top 0.152: 6.9,30.65 D101.1 7.2,29.55
  Top 0.508: SW101.2 6.9,30.65 | F101.2 7.2,29.55
  pour Top (no thermals): 2.5,31.3 6.2,31.3 6.4,31.1 8.5,31.1 8.7,30.9 8.7,27.5 8.1,26.9 6.6,26.9 6.1,27.4 6.1,29.2 5.3,30 2.5,30 2.2,30.3 2.2,31
N$2
  Top 0.508: CN602.3 24.75,53.95 27.3,51.4 50.1,51.4 51,52.3 51,57.99 R607.2
N$3
  Top 0.508: CN601.4 6.32,17.9 R604.1
N$4  (via drill 0.35)
  Top 0.152: SV1.2 56.63,23.37 54.25,25.75 53.45,25.75 RB01.1 52.5,25.8 v52.4,25.9
  Bottom 0.152: SJB01.1 52.25,25.75 v52.4,25.9
N$6  (via drill 0.35)
  Top 0.127: IC201.5 12.65,34 v12.58,34.07
  Top 0.152: v12.6,35.79 12.8,35.79 13.2,35.39 13.89,35.39 IC201.8
  Bottom 0.152: v12.58,34.07 12.58,34.9 12.58,35.79 v12.6,35.79
N$8  (via drill 0.35)
  Top 0.15: IC301.5 15.34,30 v15.42,29.92
  Top 0.152: v15.4,28.2 15.2,28.4 14.32,28.4 IC301.8
  Bottom 0.152: v15.42,29.92 15.4,29.9 v15.4,28.2
N$9  (via drill 0.35)
  Top 0.152: IC801.5 22.23,40.65 v22.14,40.73 | v21,40.5 R804.2
  Bottom 0.152: v22.14,40.73 21.91,40.5 v21,40.5
N$10
  Top 0.152: D802.1 10.25,40.5 R804.1
N$11  (via drill 0.3)
  Top 0.152: OP601.2 OP601.1 24.2,22.91 24.15,22.85 v24.15,22.55 | v25.92,22.8 R802.2
  Bottom 0.152: v24.15,22.55 25.37,22.55 25.62,22.8 v25.92,22.8 25.96,22.84 SJ801.2
  pour Top (no thermals): 25.6,22.9 26,23.3 27.5,23.3 27.5,22.2 26,22.2 25.6,22.6
  pour Top (no thermals): 22.5,23 23.3,23 24,22.3 24.6,22.3 24.6,24.4 22.5,24.4
N$12  (via drill 0.35)
  Top 0.152: ICC01.26 47.83,32.44 47.83,31.63 v48.13,31.33 | v18.5,44.04 17.54,45 RC01.2 | v18.5,35.49 v18.5,39.5
  Bottom 0.152: v48.13,31.33 48.49,30.98 48.49,26.17 47.12,24.8 33.2,24.8 31.5,26.5 25,26.5 18.5,33 v18.5,35.49 | v18.5,39.5 v18.5,44.04
N$13
  Top 0.152: RC01.1 10.25,45 DC01.1
N$14
  Top 0.508: PTC601.2 51.29,51.2 50.66,50.58 26.62,50.58 24.52,52.68 21.04,52.68 CN602.2
N$15
  Top 0.152: OP601.3 21.63,23.79 R606.2 21.63,26.27 21.4,26.5 17.28,26.5 R605.1
  pour Top (no thermals): 16.5,27.16 17.64,27.16 17.83,26.97 21.73,26.97 22,26.7 22,23 21.3,23 21.3,25.9 20.86,26.34 16.5,26.34
N$16
  Top 0.152: OP601.5 20.28,17.33 18.8,17.33 18.67,17.2 R603.2 15.14,17.39 R602.1
  pour Top (no thermals): 14.7,21 15.6,21 16,20.6 16,18.6 16.6,18 19.6,18 19.7,18.1 20.8,18.1 20.8,16.8 16.3,16.8 15.9,16.4 14.1,16.4 14.1,19.3 14.7,19.9
N$17
  Top 0.152: R604.2 9.4,16.2 R603.3
  pour Top (no thermals): 8.8,16.9 12.4,16.9 12.4,15.5 8.7,15.5 8.7,16.9
N$18  (via drill 0.35)
  Top 0.152: IC801.4 22.49,41.15 v22.14,41.5 | v21,41.5 20,42.5 14.52,42.5 R803.1
  Bottom 0.152: v22.14,41.5 v21,41.5
N$19
  Top 0.152: 17.07,25.21 R605.2
  Top 0.305: 17.07,25.21 17.47,24.81 C601.P$1 18.19,23.61 21.8,20 23.8,20 25.14,18.66 25.14,16.84 24.7,16.4 23.2,16.4 22.93,16.66 OP601.7 | Q601.1 15.45,24.76 15.9,25.21 R605.2
N$20
  Top 0.152: 9.96,20.24 R601.1
  Top 0.305: CN601.1 1.57,18.27 | R601.1 9.94,20.4
  Top 0.508: 1.57,18.27 3.7,20.4 9.94,20.4 | 9.96,20.24 10.8,19.4 12.6,19.4 13.5,18.5 13.5,16.3 14.3,15.5 20.73,15.5 21.66,16.43 OP601.6
N$21  (via drill 0.3)
  Top 0.127: 52.5,33.9 51.82,34.58 45.08,34.58 44.78,34.88 44.78,40.8 42.52,43.05 41.96,43.05 40.95,44.07 39.23,44.07 38.68,43.52 38.28,43.52
  Top 0.152: ICC01.30 52.84,33.56 52.5,33.9 | 38.28,43.52 36.48,43.52 34.59,45.42 31.1,45.42 v30.75,45.07 | IC801.1 v23.79,42.65 v23.78,42.66
  Bottom 0.152: v30.75,45.07 30.3,44.62 30.3,43 29.54,42.24 24.2,42.24 v23.78,42.66
N$22  (via drill 0.35)
  Top 0.127: IC801.15 28.28,37.93 29.05,37.15 29.05,36.95 v29.5,36.5 | v39.5,33 40.63,33 41.06,33.44 44.62,33.44 44.78,33.28 44.78,33.01 ICC01.24
  Bottom 0.127: v39.5,33 39,33.5 37,33.5 35.5,35 32.29,35 31.38,35.91 30.09,35.91 v29.5,36.5
N$23  (via drill 0.35)
  Top 0.127: v29.59,37.23 29.49,37.23 28.78,37.94 IC801.16 | v40,33.53 40.69,33.53 40.93,33.77 48.04,33.77 49.09,32.72 ICC01.27
  Bottom 0.127: v29.59,37.23 30.03,36.78 30.03,36.5 30.29,36.24 34.73,36.24 37.13,33.84 39.13,33.84 39.44,33.53 v40,33.53
N$25  (via drill 0.3)
  Top 0.152: R802.1 28,24.4 28.1,24.3 C806.P$1 v29,25.5 25.9,28.6 v25.9,31.5 | IC801.12 26.78,37.81 27.03,37.56 v27.42,37.56
  Bottom 0.152: SJ801.1 27.5,25.06 27.94,25.5 v29,25.5 | v25.9,31.5 25.9,31.8 27.7,33.6 27.7,37.28 v27.42,37.56
  pour Top (no thermals): 26.3,23.9 26.4,23.8 29.5,23.8 29.5,25.6 29.3,25.8 28.7,25.8 28.7,25.5 28.3,25.1 26.5,25.1 26.3,24.9
N$26
  Top 0.508: B1.1 5.29,25.79 F101.1
N$30
  Top 0.152: R602.2 R601.2
  Top 0.305: Q601.2 12.75,21.81 11.56,20.62 R601.2
  pour Top (no thermals): 12.4,25.4 13.1,25.4 13.1,21.8 13.4,21.5 14,20.9 14,19.9 11.1,19.9 11.1,21 12.4,22.3
N$31  (via drill 0.35)
  Top 0.152: ICA01.7 2.52,46.33 2.8,46.6 20.4,46.6 v20.5,46.5 | RN901.6 23.88,45.05 v23.97,44.97
  Bottom 0.152: v23.97,44.97 22.03,44.97 v20.5,46.5
  pour Top (no thermals): 2.16,45.55 2.91,45.55 2.91,46.41 3.15,46.65 2.4,46.65 2.16,46.41
N$39
  Top 0.152: R803.2 9.53,42.72 D801.1
N$49  (via drill 0.3)
  Top 0.152: IC801.32 25.28,43.61 25.09,43.8 22.3,43.8 21.6,43.1 21.6,39.85 22.26,39.19 22.26,37.5 v23.11,36.64 v23.12,36.65 | SW801.1 30.38,20.1 30,20.1 28.6,21.5 26.1,21.5 25.3,22.3 25.3,27.11 24.31,28.1 v24.2,28.1 24.15,28.15 RN801.6
  Bottom 0.152: v23.12,36.65 23.12,31.18 24.2,30.1 v24.2,28.1
  pour Top (no thermals): 31.6,19.25 29.6,19.25 29.6,20.45 31.6,20.45
N$50
  Top 0.152: IC801.20 31.25,40.65 31.75,40.15 X801.1 32.95,40.15 33,40.1 C804.P$1
  pour Top (no thermals): 34.55,40.65 34.55,39.55 31.35,39.55 31.35,40.65
N$51
  Top 0.152: IC801.21 31.25,41.15 31.75,41.65 X801.2 32.95,41.65 33,41.7 C805.P$1
  pour Top (no thermals): 34.55,42.25 34.55,41.15 31.35,41.15 31.35,42.25
N$56  (via drill 0.3)
  Top 0.152: RN801.5 22.83,27.6 24.9,25.53 24.9,21.6 26.62,19.88 SWC01.1 27,19.48 27.82,19.48 28.6,18.7 31.4,18.7 33.2,20.5 44.4,20.5 45.6,21.7 v45.6,28.2 | v45.6,29.9 46.48,30.78 53.53,30.78 54.09,31.34 ICC01.31
  Bottom 0.152: v45.6,29.9 v45.6,28.2
N$57
  Top 0.254: ICA01.6 ICA01.5
  pour Top (no thermals): 3.23,46.26 5.04,46.26 5.04,45.55 3.23,45.55
N$61  (via drill 0.3, 0.35)
  Top 0.152: IC801.14 27.78,37.93 28.71,37 v28.71,36.49 | v36.81,33.01 CB02.P$1 37.8,31.9 38.3,31.4 43.3,31.4 46.2,28.5 46.2,24.8 v47,24 | v52.4,24 53.2,24 RB01.2
  Bottom 0.152: v28.71,36.49 29.64,35.56 31.24,35.56 32.2,34.6 35.22,34.6 v36.81,33.01 | v47,24 49.66,24 49.9,24.24 SJB01.2 52.16,24.24 v52.4,24
  pour Top (no thermals): 36.6,32.9 38.1,31.4 38.4,31.4 38.4,33.5 36.8,33.5 36.6,33.3
RXD  (via drill 0.3)
  Top 0.152: ICC01.3 52.84,44.44 51.8,43.4 42.1,43.4 41.06,44.45 39.01,44.45 38.46,43.9 36.67,43.9 34.79,45.78 30.73,45.78 29.81,44.85 26.94,44.85 v26.79,44.7 | IC801.31 25.78,44.71 v25.75,44.74
  Bottom 0.152: v26.79,44.7 26.75,44.74 v25.75,44.74
  pour Top (no thermals): 52.4,46.3 53.3,46.3 53.3,44.8 51.87,43.37 51.37,43.37 52.4,44.4
SCK
  Top 0.152: IC801.8 24.53,37.71 26.84,35.4 27.8,35.4 28.25,34.94 31.65,34.94 32.15,34.44 34.15,34.44 37.95,30.64 39.36,30.64 39.58,30.42 J701.5
  pour Top (no thermals): 39.2,28.5 39.2,30.5 39.04,30.66 39.4,30.66 40,30.06 40,28.5
SCL  (via drill 0.3, 0.35)  (1 unrouted)
  Top 0.127: U$4.2 94.78,11.08
  Top 0.152: v31.7,43.49 31.49,43.49 30.15,42.15 IC801.23 | RN901.8 v24.58,46.1 v24.59,46.1 | ICA01.2 2.52,44.42 2.94,44.84 4.96,44.84 5.3,44.5 5.3,43.2 v5.5,43 | v47.5,26.2 47.52,26.2 48.6,25.13 48.61,25.13 51.24,22.5 54.8,22.5 55.5,21.8 55.5,19.5 56.64,18.36 SV1.4 | v45.8,7.7 45.84,7.74
  Top 0.2: IC901B.3 45.84,7.74 | 94.78,11.08 94,11.08 93.02,10.1 72.9,10.1 72.7,9.9 v72.2,9.9
  Bottom 0.152: v47.5,26.2 47.5,38.3 44.4,41.4 36.9,41.4 36.3,42 36.3,43 35.06,44.24 32.61,44.24 31.86,43.49 v31.7,43.49 31.7,45.6 30.55,46.76 25.23,46.76 v24.59,46.1 24.59,44.41 22.9,42.73 22.9,38.6 21.06,36.76 9.34,36.76 8,38.1 8,40.5 v5.5,43
  Bottom 0.2: v45.8,7.7 44.6,7.7 43.7,6.8 14.7,6.8 13.9,7.6 | 13.9,7.6 9.18,7.6 SV2.4 | 13.9,7.6 17.3,11 69.7,11 70.8,9.9 v72.2,9.9
  pour Top (no thermals): 2.17,43.56 2.91,43.56 2.91,44.46 3.36,44.91 2.65,44.91 2.17,44.43
SDA  (via drill 0.3, 0.35)  (1 unrouted)
  Top 0.127: U$4.1 94.78,11.73
  Top 0.152: v46.9,28.6 46.9,25.3 53.97,18.23 SV1.3 | v32.2,42.9 31.5,42.9 30.25,41.65 IC801.22 | v25.39,45.86 25.08,45.55 RN901.7 | ICA01.8 1.7,45.68 1.7,45.4 1.9,45.2 5.11,45.2 5.7,44.61 5.7,43.6 7.2,42.1 v7.2,40.4 | SV2.3 10.59,8.77 | v45.8,5.75 45.81,5.77 | v13.53,7.05 13.53,7.1
  Top 0.2: 10.59,8.77 11.88,8.77 13.53,7.1 | 45.81,5.77 IC901B.4 | v70.7,11.3 72,11.3 72.3,11 93.27,11 94,11.73 94.78,11.73
  Bottom 0.152: v46.9,28.6 46.9,38.1 43.96,41.04 36.56,41.04 35.8,41.8 35.8,43 34.91,43.88 32.88,43.88 32.2,43.2 v32.2,42.9 31.4,42.9 | v25.39,45.86 26.56,45.86 27.1,46.4 30.3,46.4 31.3,45.4 31.3,44.7 31.1,44.5 31.1,43.2 31.4,42.9 | 31.4,42.9 30.2,41.7 28.6,41.7 24.21,37.31 22.26,37.31 21.28,36.34 9.16,36.34 7.2,38.3 v7.2,40.4
  Bottom 0.2: v13.53,7.05 14.32,6.25 45.3,6.25 v45.8,5.75 | v70.7,11.3 70.3,11.3 70.1,11.5 17,11.5 14.25,8.75 SV2.3
  pour Top (no thermals): 1.05,46.3 1.85,46.3 1.85,45.4 1.95,45.3 1.95,45.17 1.38,45.17 1.05,45.5
SLEEP  (via drill 0.3)
  Top 0.152: v29.5,43.32 29.42,43.4 IC801.25 | ICC01.9 45.34,46.41 45.19,46.56 30.27,46.56 v29.6,45.89
  Bottom 0.152: v29.5,43.32 29.9,43.72 29.9,45.59 v29.6,45.89
TXD  (via drill 0.35)
  Top 0.152: ICC01.4 51.59,44.59 51,44 v50,44 | IC801.30 26.28,44.92 26.57,45.21 29.65,45.21 30.58,46.14 39.23,46.14 v39.46,45.92
  Bottom 0.152: v50,44 49.1,44 48.93,43.83 41.54,43.83 v39.46,45.92
  pour Top (no thermals): 51.2,46.3 52,46.3 52,44.6 51.38,43.98 50.48,43.98 51.2,44.7
UPID
  Top 0.152: PN801.2 37.01,42.48 34.43,45.06 31.49,45.06 30.92,44.49 28.2,44.49 27.78,44.07 IC801.27
VBAT  (via drill 0.3, 0.35)
  Top 0.127: IC201.1 15.25,33.45 15.6,33.1 15.6,32.78 15.54,32.72 | v15.56,35.12 15.56,34.72 15.39,34.55 IC201.3 | IC301.1 12.5,31.2 12.5,31.22
  Top 0.152: 21.35,33.5 IC401.3 C401.P$1 | 12.5,31.22 12.5,31.28
  Top 0.254: 21.35,33.5 v22.3,33.5 v22.3,35.2 22.05,35.45 IC401.1
  Top 0.305: C301.P$2 11.68,31.28 12.5,31.28 IC301.7 IC201.7 15.54,32.72 16.42,32.72 C201.P$2 16.85,33 v17.96,33 18.9,33 v19.1,33.2
  Top 0.508: SW101.3 5.35,33.15 6.7,31.8 10.41,31.8 C301.P$2
  Bottom 0.127: v17.96,33 16.6,33 15.56,34.04 v15.56,35.12
  Bottom 0.508: v19.1,33.2 22,33.2 v22.3,33.5
  pour Top (no thermals): 20.7,32.9 22,32.9 22.8,33.7 22.8,35.1 22.2,35.7 20.7,35.7 20.7,35.2 22.1,35.2 22.2,35.1 22.2,33.9 22.1,33.8 20.7,33.8
  pour Top (no thermals): 20.7,33.8 20.7,31.6 20.8,31.5 21.9,31.5 22,31.6 22,33.8
  pour Top (no thermals): 10.5,31.7 12.3,31.7 12.9,32.3 12.9,33 14.7,33 14.7,33.6 16,33.6 16.1,33.7 19.2,33.7 19.4,33.5 19.4,32.7 19,32.3 15.8,32.3 15.1,31.6 15.1,31 13.3,31 13.3,30.4 12.2,30.4 12.1,30.3 10.5,30.3

### Text on the board
tPlace: MLS01-TG000-C08 Lot:2403 | GND | 2.0-3.0V | - | ON | OFF | + | MLS01-TG000 / -C08 Lot:2403 | Cx | Rst | VEL | MLS01-TG000-C08 Lot:2403
_tPlace: R607
_tNames: R607 | CN602 | PTC601 | X801 | PN801 | PN801 | ICC01 | ICC01 | RC01 | RC01 | C803 | C803 | D802 | D801 | D801 | DC01 | IC801 | IC801 | C805 | C805 | R803 | R803 | ICA01 | ICA01 | RN901 | C804 | C804 | R804 | R804 | C807 | C807 | CA01 | CA01 | C802 | C802 | C202 | IC201 | C201 | CC01 | CC01 | D101 | C401 | C401 | C302 | B1 | CB02 | IC401 | IC401 | J701 | J701 | C402 | SW101 | C301 | IC301 | OP601 | OP601 | RB01 | Q601 | RN801 | RN801 | R802 | R802 | C701 | C701 | F101 | F101 | R606 | R606 | R605 | C806 | C806 | R602 | R602 | C601 | R601 | R601 | CN601 | SW801 | SW801 | R603 | R604 | SV1 | SWC01 | PNB01 | CB01 | CB01 | C901B | SV2 | IC901B
_bNames: SJB01 | SJ801 | SJ801
_tValues: C202 | IC201 | C201 | C302 | IC301 | C301